# Altium schematic sheet 02-PSU-ps2-blueretro.SchDoc
size A; SheetNumber: 3; SheetTotal: 6
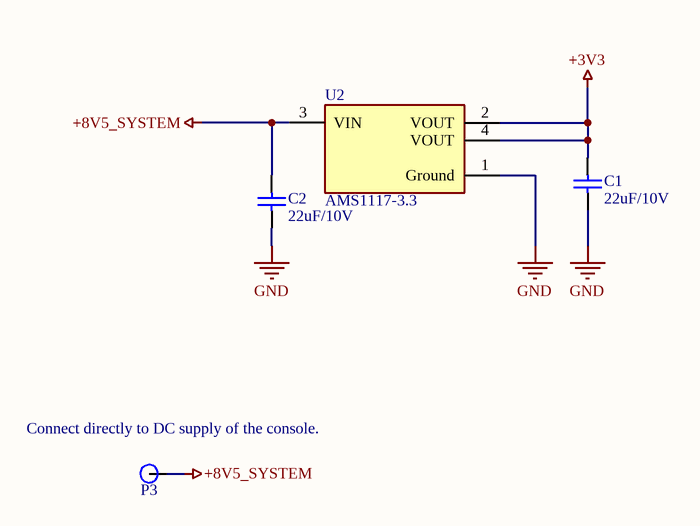
[diagram p0: 02-PSU-ps2-blueretro.SchDoc]

## Parts
C1  value 22uF/10V  [cap_0603]  (hidden comment: cap_0603)
C2  value 22uF/10V  [cap_0603]  (hidden comment: cap_0603)
P3  Solder_Contact_2mm  [SINGLE_SOLDER_CON]  (value not drawn)
U2  AMS1117-3.3  [FP-AMS1117-IPC_C]

## Nets
+3V3: C1.2 U2.2(VOUT) U2.4(VOUT)
+8V5_SYSTEM: C2.2 P3.1 U2.3(VIN)
GND: C1.1 C2.1 U2.1(Ground)

## Notes on the sheet
- (near P3) Connect directly to DC supply of the console.

## Library data of the parts
U2 = CMP-209535-000001-1: LDO Voltage Regulators 1A, 3.3V; Manufacturer: Advanced Monolithic Systems; Dropout Voltage: 1.1V; Output Type: Fixed; Nominal Supply Current: 5mA; Max Power Dissipation: 1.2W; Max Supply Voltage: 15V; Number Of Outputs: 1; Standoff Height: 0.64mm; Max Junction Temp: +125°C; Height: 1.8mm; Package: AMS1117; Device Class L2: Power Management ICs; ComponentLink2Description: Datasheet; ComponentLink2URL: http://www.advanced-monolithic.com/pdf/ds1117.pdf; Category: IC; RoHS: TRUE; Automotive: No; Device Class L1: Integrated Circuits (ICs); Output Current: 1A; Device Class L3: Voltage Regulators - Linear; Temperature: -40°C to +125°C; Output Voltage: 3.3V; Manufacturer Part Number: AMS1117-3.3; Temperature Range Low: -40°C; Octopart: https://octopart.com/ams1117-3.3-advanced+monolithic+systems-25899300; Lead Free: Yes; Ipc Land Pattern Name: SOT229P700X180-4; Temperature Range High: +125°C